# Altium schematic sheet sample_circuit.SchDoc
size A4; Organization: Badgerloop; Address1: 133 Engineering Research; Address2: Building; Address3: Madison, WI 53715
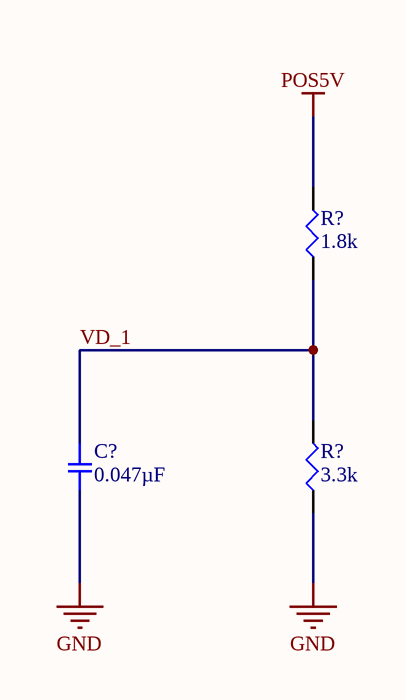
[diagram p0: sample_circuit.SchDoc]

## Parts
(Parts that share a designator on the sheet are numbered #1, #2 ... from top to bottom, then left to right.)
C?  0.047µF  [SMD-0805C]
R?#1  1.8k  [SMD-0402-RES]
R?#2  3.3k  [SMD-0402-RES]

## Nets
GND: C?.2 R?#2.1
POS5V: R?#1.2
VD_1: C?.1 R?#1.1 R?#2.2

## Notes on the sheet
- Title
- Size:
- Date:
- A4
- Number:
- Time:
- Revision:
- Sheet
- of
- File:

## Library data of the parts
C? = GCJ21BR72A473KA01L: CAP CER 0.047UF 100V X7R 0805; Manufacturer: Murata Electronics North America; Factory Stock: 0; Unit Price (USD): 0.31; Minimum Quantity: 1; Tolerance: ±10%; Datasheets: http://www.murata.com/~/media/webrenewal/support/library/catalog/products/capacitor/mlcc/c03e.ashx; Image: //media.digikey.com/Renders/Murata%20Renders/0805%20(2012%20Metric)%20.85mm.jpg; Digi-Key Part Number: 490-5826-1-ND; Part Number: GCJ21BR72A473KA01L; Quantity Available: 651; @ qty: 0; Packaging: Cut Tape (CT); Series: GCJ; Part Status: Active; Value: 0.047µF; Voltage: 100V; Temperature Coefficient: X7R; Operating Temperature: -55°C ~ 125°C; Features: Soft Termination; Ratings: AEC-Q200; Applications: Automotive, Boardflex Sensitive; Mounting Type: Surface Mount, MLCC; Package / Case: 0805 (2012 Metric); Size / Dimension: 0.079" L x 0.049" W (2.00mm x 1.25mm); Height - Seated (Max): -; Thickness (Max): 0.049" (1.25mm); Lead Spacing: -; Lead Style: -
R?#1 = ERJ-2BQFR30X: RES SMD 1.8 kOHM 1% 1/6W 0402; Manufacturer: Panasonic Electronic Components; Factory Stock: 0; Unit Price (USD): 0.10080; @ qty: 1500; Minimum Quantity: 1; Power (Watts): 0.167W, 1/6W; Temperature Coefficient: ±250ppm/°C; Part Number: ERJ-2BQFR30X; Datasheets: https://industrial.panasonic.com/cdbs/www-data/pdf/RDA0000/AOA0000C239.pdf; Image: //media.digikey.com/Photos/Panasonic%20Photos/ERJ-PA2-Series.jpg; Digi-Key Part Number: P.30AKCT-ND; Quantity Available: 28841; Packaging: Cut Tape (CT); Series: ERJ; Part Status: Active; Value: 1.8k; Tolerance: ±1%; Composition: Thick Film; Features: Automotive AEC-Q200, Current Sense; Operating Temperature: -55°C ~ 125°C; Package / Case: 0402 (1005 Metric); Supplier Device Package: 0402; Size / Dimension: 0.039" L x 0.020" W (1.00mm x 0.50mm); Height - Seated (Max): 0.016" (0.40mm); Number of Terminations: 2; Failure Rate: -
R?#2 = ERJ-2BQFR33X: RES SMD 0.33 OHM 1% 1/6W 0402; Manufacturer: Panasonic Electronic Components; Factory Stock: 0; Unit Price (USD): 0.10080; @ qty: 1500; Minimum Quantity: 1; Power (Watts): 0.167W, 1/6W; Temperature Coefficient: ±250ppm/°C; Part Number: ERJ-2BQFR33X; Datasheets: https://industrial.panasonic.com/cdbs/www-data/pdf/RDA0000/AOA0000C239.pdf; Image: //media.digikey.com/Photos/Panasonic%20Photos/ERJ-PA2-Series.jpg; Digi-Key Part Number: P.33AKCT-ND; Quantity Available: 25648; Packaging: Cut Tape (CT); Series: ERJ; Part Status: Active; Value: 3.3k; Tolerance: ±1%; Composition: Thick Film; Features: Automotive AEC-Q200, Current Sense; Operating Temperature: -55°C ~ 125°C; Package / Case: 0402 (1005 Metric); Supplier Device Package: 0402; Size / Dimension: 0.039" L x 0.020" W (1.00mm x 0.50mm); Height - Seated (Max): 0.016" (0.40mm); Number of Terminations: 2; Failure Rate: -